# Altium project rpi-hat-v3.PrjPcb
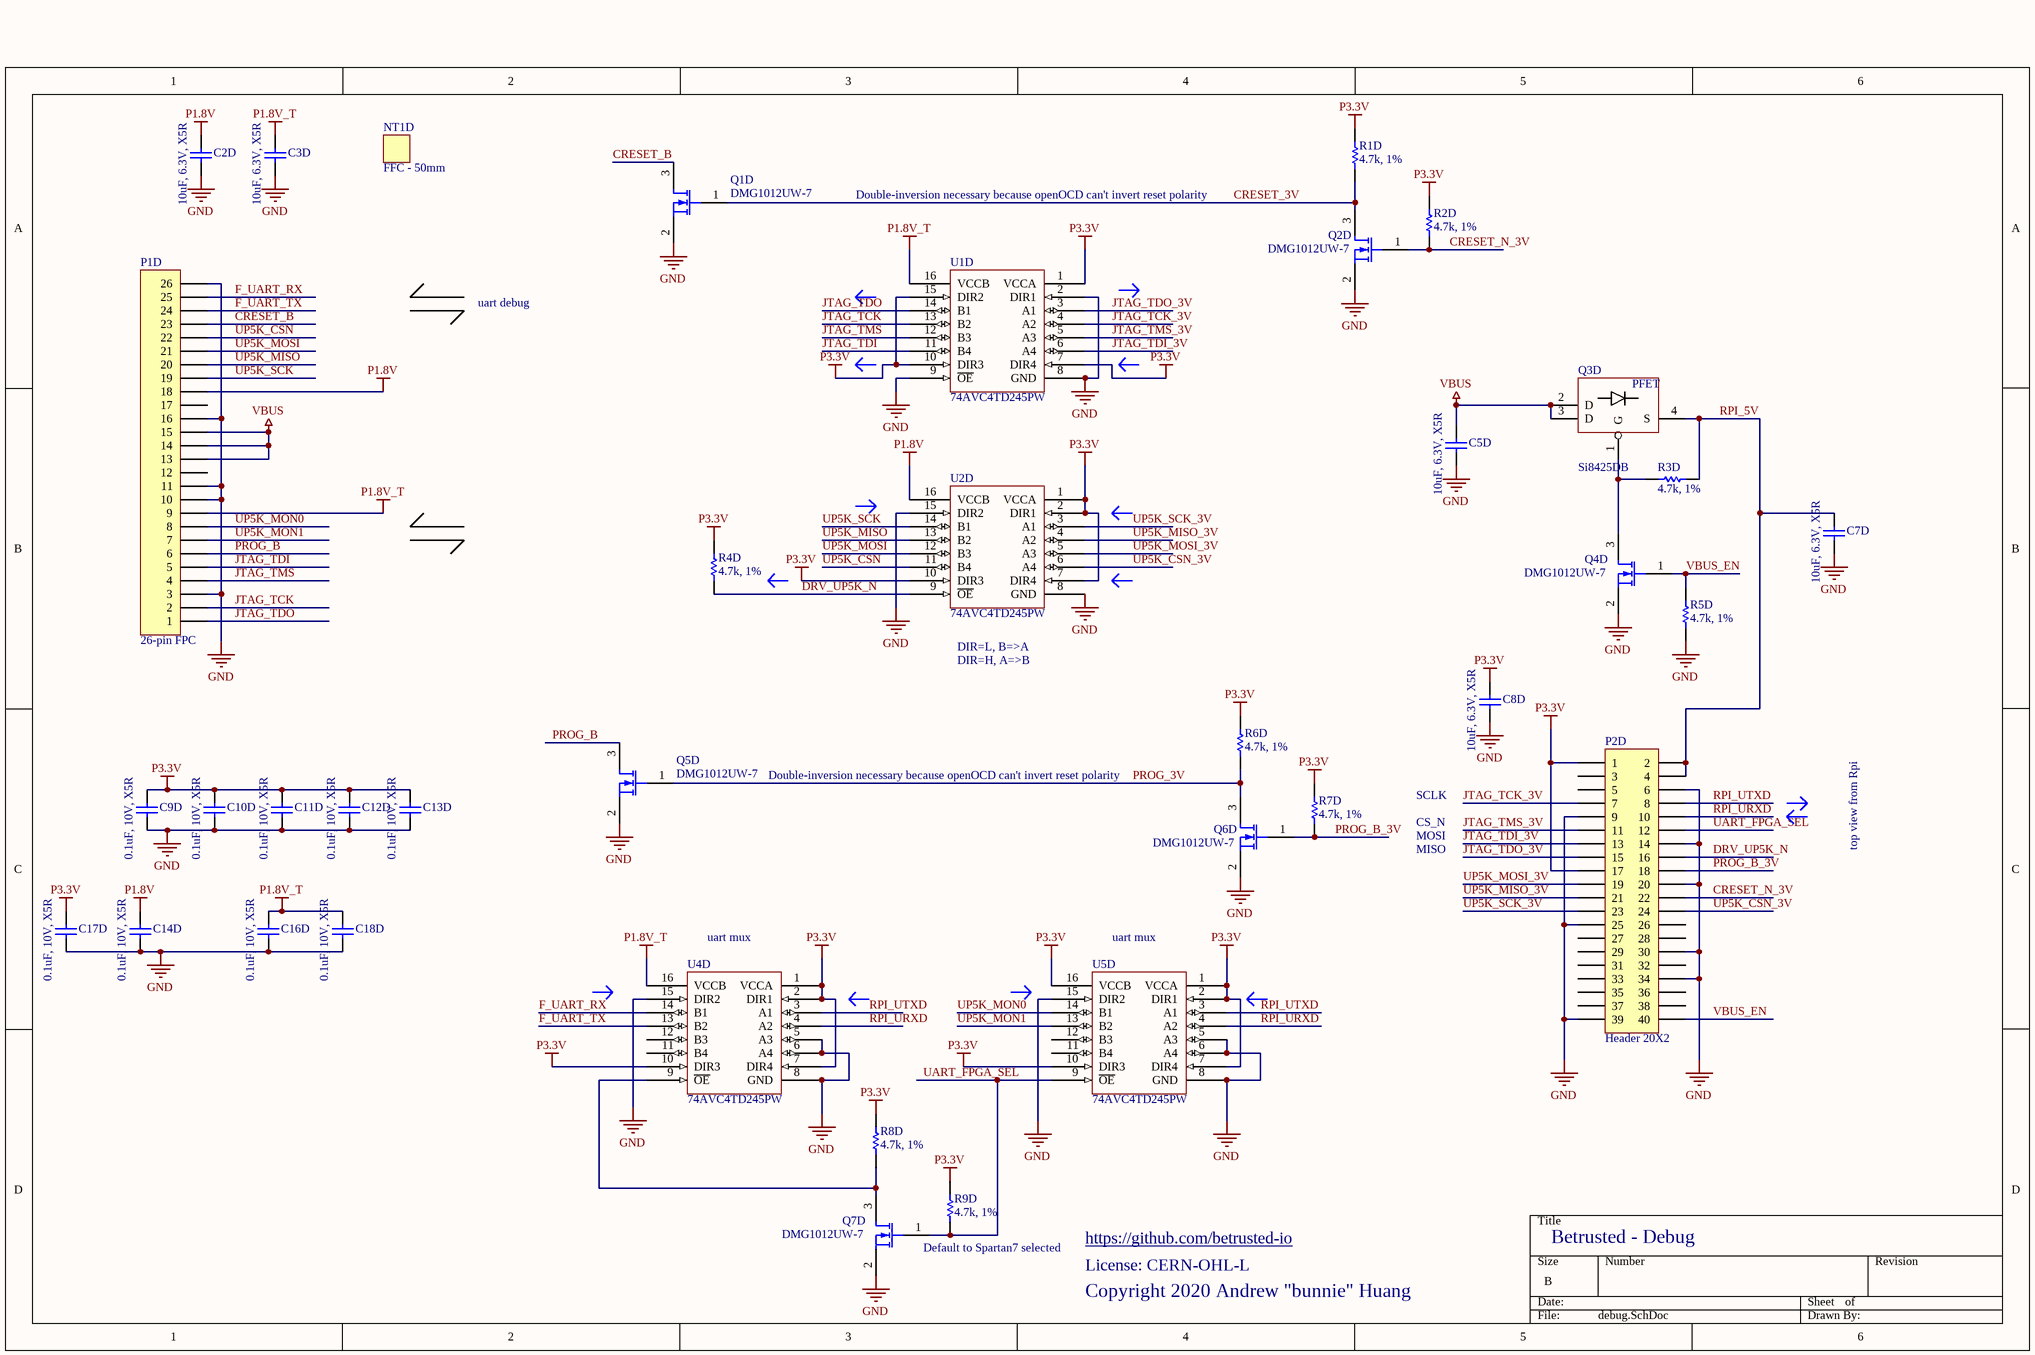
[diagram p0: debug.SchDoc]
2 sheets, 42 parts. Net scope: global (net labels, ports and power ports of the same name join across sheets).
Board file: rpi-hat-v3c.PcbDoc
Sheets:
  debug.SchDoc
  breakout.SchDoc

## Sheet debug.SchDoc
size B

### Parts
C2D  10uF, 6.3V, X5R  [B_CAP0603]
C3D  10uF, 6.3V, X5R  [B_CAP0603]
C5D  10uF, 6.3V, X5R  [B_CAP0603]
C7D  10uF, 6.3V, X5R  [B_CAP0603]
C8D  10uF, 6.3V, X5R  [B_CAP0603]
C9D  0.1uF, 10V, X5R  [B_CAP0402]
C10D  0.1uF, 10V, X5R  [B_CAP0402]
C11D  0.1uF, 10V, X5R  [B_CAP0402]
C12D  0.1uF, 10V, X5R  [B_CAP0402]
C13D  0.1uF, 10V, X5R  [B_CAP0402]
C14D  0.1uF, 10V, X5R  [B_CAP0402]
C16D  0.1uF, 10V, X5R  [B_CAP0402]
C17D  0.1uF, 10V, X5R  [B_CAP0402]
C18D  0.1uF, 10V, X5R  [B_CAP0402]
NT1D  FFC - 50mm
P1D  26-pin FPC  [HRS_FH34SRJ-26S-0.5SH(50)]
P2D  Header 20X2  [SAMTEC_SSW-120-01-F-D]
Q1D  DMG1012UW-7  [SOT323-3AN]
Q2D  DMG1012UW-7  [SOT323-3AN]
Q3D  Si8425DB  [VISHAY_MICRO_FOOT_4_BUMP]
Q4D  DMG1012UW-7  [SOT323-3AN]
Q5D  DMG1012UW-7  [SOT323-3AN]
Q6D  DMG1012UW-7  [SOT323-3AN]
Q7D  DMG1012UW-7  [SOT323-3AN]
R1D  4.7k, 1%  [B_RES0402]
R2D  4.7k, 1%  [B_RES0402]
R3D  4.7k, 1%  [B_RES0402]
R4D  4.7k, 1%  [B_RES0402]
R5D  4.7k, 1%  [B_RES0402]
R6D  4.7k, 1%  [B_RES0402]
R7D  4.7k, 1%  [B_RES0402]
R8D  4.7k, 1%  [B_RES0402]
R9D  4.7k, 1%  [B_RES0402]
U1D  74AVC4TD245PW  [TSOP65P640-16AN]
U2D  74AVC4TD245PW  [TSOP65P640-16AN]
U4D  74AVC4TD245PW  [TSOP65P640-16AN]
U5D  74AVC4TD245PW  [TSOP65P640-16AN]

### Nets
GND: C2D.2 C3D.2 C5D.2 C7D.2 C8D.2 C9D.2 C10D.2 C11D.2 C12D.2 C13D.2 C14D.2 C16D.2 C17D.2 C18D.2 P1D.3 P1D.10 P1D.11 P1D.16 P1D.26 P2D.6 P2D.9 P2D.14 P2D.20 P2D.25 P2D.30 P2D.34 P2D.39 Q1D.2(S) Q2D.2(S) Q4D.2(S) Q5D.2(S) Q6D.2(S) Q7D.2(S) R5D.1 U1D.2(DIR1) U1D.8(GND) U1D.9(~{OE}) U2D.8(GND) U2D.15(DIR2) U4D.5(A3) U4D.6(A4) U4D.8(GND) U4D.15(DIR2) U5D.5(A3) U5D.6(A4) U5D.8(GND) U5D.15(DIR2)
P1.8V: C2D.1 C14D.1 P1D.18 U2D.16(VCCB)
P1.8V_T: C3D.1 C16D.1 C18D.1 P1D.9 U1D.16(VCCB) U4D.16(VCCB)
P3.3V: C8D.1 C9D.1 C10D.1 C11D.1 C12D.1 C13D.1 C17D.1 P2D.1 P2D.17 R1D.2 R2D.2 R4D.2 R6D.2 R7D.2 R8D.2 R9D.2 U1D.1(VCCA) U1D.7(DIR4) U1D.10(DIR3) U1D.15(DIR2) U2D.1(VCCA) U2D.2(DIR1) U2D.7(DIR4) U2D.10(DIR3) U4D.1(VCCA) U4D.2(DIR1) U4D.7(DIR4) U4D.10(DIR3) U5D.1(VCCA) U5D.2(DIR1) U5D.7(DIR4) U5D.10(DIR3) U5D.16(VCCB)
VBUS: C5D.1 P1D.13 P1D.14 P1D.15 Q3D.2(D) Q3D.3(D)
CRESET_3V: Q1D.1(G) Q2D.3(D) R1D.1
CRESET_B: P1D.23 Q1D.3(D)
CRESET_N_3V: P2D.22 Q2D.1(G) R2D.1
DRV_UP5K_N: P2D.16 R4D.1 U2D.9(~{OE})
F_UART_RX: P1D.25 U4D.14(B1)
F_UART_TX: P1D.24 U4D.13(B2)
JTAG_TCK: P1D.2 U1D.13(B2)
JTAG_TCK_3V: P2D.7 U1D.4(A2)
JTAG_TDI: P1D.5 U1D.11(B4)
JTAG_TDI_3V: P2D.13 U1D.6(A4)
JTAG_TDO: P1D.1 U1D.14(B1)
JTAG_TDO_3V: P2D.15 U1D.3(A1)
JTAG_TMS: P1D.4 U1D.12(B3)
JTAG_TMS_3V: P2D.11 U1D.5(A3)
PROG_3V: Q5D.1(G) Q6D.3(D) R6D.1
PROG_B: P1D.6 Q5D.3(D)
PROG_B_3V: P2D.18 Q6D.1(G) R7D.1
RPI_5V: C7D.1 P2D.2 P2D.4 Q3D.4(S) R3D.1
RPI_URXD: P2D.10 U4D.4(A2) U5D.4(A2)
RPI_UTXD: P2D.8 U4D.3(A1) U5D.3(A1)
UART_FPGA_SEL: P2D.12 Q7D.1(G) R9D.1 U5D.9(~{OE})
UP5K_CSN: P1D.22 U2D.11(B4)
UP5K_CSN_3V: P2D.24 U2D.6(A4)
UP5K_MISO: P1D.20 U2D.13(B2)
UP5K_MISO_3V: P2D.21 U2D.4(A2)
UP5K_MON0: P1D.8 U5D.14(B1)
UP5K_MON1: P1D.7 U5D.13(B2)
UP5K_MOSI: P1D.21 U2D.12(B3)
UP5K_MOSI_3V: P2D.19 U2D.5(A3)
UP5K_SCK: P1D.19 U2D.14(B1)
UP5K_SCK_3V: P2D.23 U2D.3(A1)
VBUS_EN: P2D.40 Q4D.1(G) R5D.2
NetQ3D_1: Q3D.1(G) Q4D.3(D) R3D.2
NetQ7D_3: Q7D.3(D) R8D.1 U4D.9(~{OE})

Not connected (* = marked no-connect by the designer): P1D 12 17; P2D 3 5 26 27 28 29 31 32 33 35 36 37 38; U4D 11(B4) 12(B3); U5D 11(B4) 12(B3)

### Notes on the sheet
- Double-inversion necessary because openOCD can't invert reset polarity
- uart debug
- (near U2D) DIR=L, B=>A
- DIR=H, A=>B
- MOSI
- SCLK
- CS_N
- MISO
- top view from Rpi
- (near U4D) uart mux
- (near U5D) uart mux
- https://github.com/betrusted-io
- Betrusted - Debug
- Default to Spartan7 selected
- License: CERN-OHL-L
- Copyright 2020 Andrew "bunnie" Huang
- (in symbol Si8425DB) PFET

### Library data of the parts
C2D C3D C5D C7D C8D = Cap Semi: Capacitor (Semiconductor SIM Model); MPN: CL10A106MQ8NNNC; VENDOR: Samsung; MYPN: C-106-6.3-X5R-0603
C9D C10D C11D C12D C13D C14D C16D C17D C18D = Cap Semi: Capacitor (Semiconductor SIM Model); MPN: CL05A104KP5NNNC; VENDOR: Samsung; MYPN: C-104-10-X5R-0402
NT1D = NOTE: Placeholder for non-board BOM items; MPN: FJH-26-D-02.00-4; MYPN: NT-FFC-26x0.5mm-50mm; VENDOR: Samtec
P1D = FPC-26: 26 Pin FPC header; MPN: FH34SRJ-26S-0.5SH(99); MYPN: J-FPC-0.5mm-26-0.3mm-T/B; VENDOR: Hirose
P2D = Header 20X2: Header, 20-Pin, Dual row; MPN: CS25402-40G-S85-C; VENDOR: Kaweei; MYPN: P-SSW-120-01-F-D; LatestRevisionDate: 17-Jul-2002; LatestRevisionNote: Re-released for DXP Platform.; Publisher: Altium Limited
Q1D Q2D Q4D Q5D Q6D Q7D = MOSFET-N: N-Channel MOSFET; VENDOR: Diodes Inc; MYPN: Q-DMG1012UW-7; Published: 8-Jun-2000; LatestRevisionDate: 17-Jul-2002; LatestRevisionNote: Re-released for DXP Platform.; PackageVersion: 1995/1996; PackageReference: E3; Publisher: Altium Limited; MPN: DMG1012UW-7
Q3D = Si8425DB: P-channel 20V 6.2A 27mOhm @ -2.5V; MPN: SI8425DB-T1-E1; VENDOR: Vishay Siliconix; MYPN: Q-Si8425
R1D R2D R3D R4D R5D R6D R7D R8D R9D = Res1: Resistor; VENDOR: ANY; MYPN: R-472-1P-1_16W-0402; MPN: ANY
U1D U2D U4D U5D = 74AVC4TD245: 4-bit dual supply translating transceiver with configurable voltage translation; 3-state; MYPN: U-74AVC4TD245PW; VENDOR: Nexperia; MPN: 74AVC4TD245PW

## Sheet breakout.SchDoc
size A
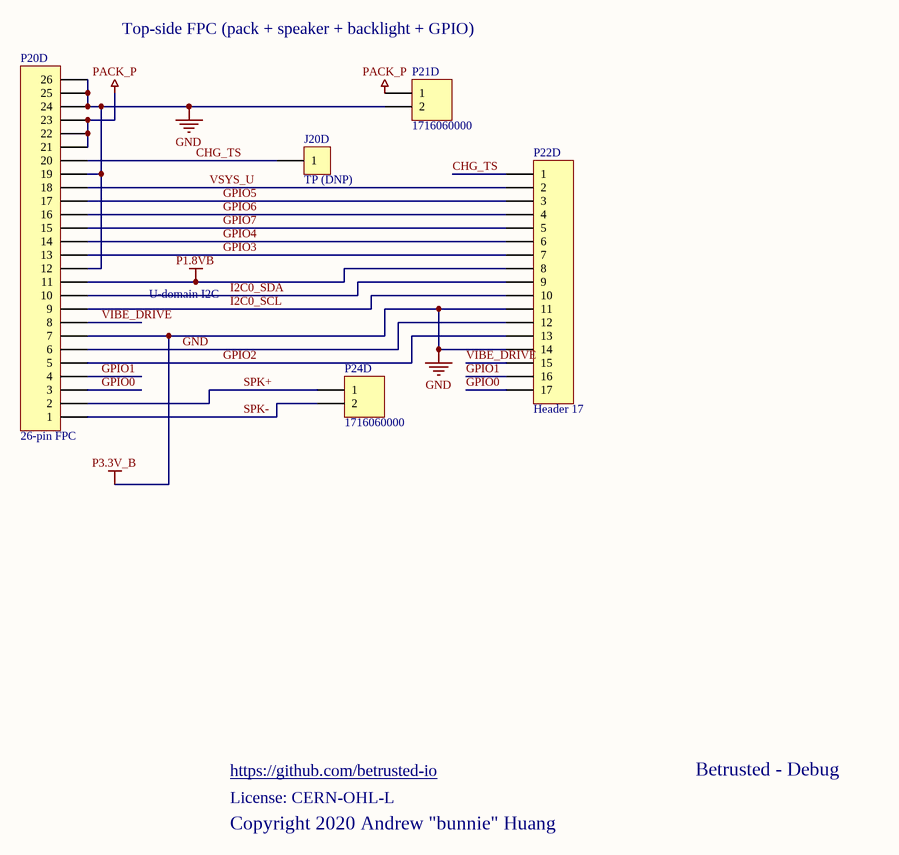
[diagram p1: breakout.SchDoc]

### Parts
J20D  TP (DNP)  [RESTAP-0603]
P20D  26-pin FPC  [HRS_FH34SRJ-26S-0.5SH(50)]
P21D  1716060000  [weidmuller_1716060000]
P22D  Header 17  [HDR1X17]
P24D  1716060000  [weidmuller_1716060000]

### Nets
GND: P20D.6 P20D.7 P20D.12 P20D.19 P20D.24 P20D.25 P20D.26 P21D.2 P22D.11 P22D.12 P22D.14  [also labelled P3.3V_B]
P1.8VB: P20D.11 P22D.8
PACK_P: P20D.21 P20D.22 P20D.23 P21D.1
CHG_TS: J20D.1 P20D.20 P22D.1
GPIO0: P20D.3 P22D.17
GPIO1: P20D.4 P22D.16
GPIO2: P20D.5 P22D.13
GPIO3: P20D.13 P22D.7
GPIO4: P20D.14 P22D.6
GPIO5: P20D.17 P22D.3
GPIO6: P20D.16 P22D.4
GPIO7: P20D.15 P22D.5
I2C0_SCL: P20D.9 P22D.10
I2C0_SDA: P20D.10 P22D.9
SPK+: P20D.2 P24D.1
SPK-: P20D.1 P24D.2
VIBE_DRIVE: P20D.8 P22D.15
VSYS_U: P20D.18 P22D.2

### Notes on the sheet
- Top-side FPC (pack + speaker + backlight + GPIO)
- U-domain I2C
- License: CERN-OHL-L
- Copyright 2020 Andrew "bunnie" Huang
- https://github.com/betrusted-io
- Betrusted - Debug

### Library data of the parts
J20D = CON1: Connector; MYPN: J-TP-PWRTAP-0603; MPN: DNP; VENDOR: DNP
P20D = FPC-26: 26 Pin FPC header; MPN: FH34SRJ-26S-0.5SH(99); MYPN: J-FPC-0.5mm-26-0.3mm-T/B; VENDOR: Hirose; System: Connector
P21D P24D = Header 2: Header, 2-Pin; VENDOR: Weidmuller; MYPN: J-TB-2P-5.08; LatestRevisionDate: 17-Jul-2002; LatestRevisionNote: Re-released for DXP Platform.; Publisher: Altium Limited; MPN: 1716060000
P22D = Header 17: Header, 17-Pin; LatestRevisionDate: 17-Jul-2002; LatestRevisionNote: Re-released for DXP Platform.; Publisher: Altium Limited

## Nets that join several sheets
GND: debug (47 pins), breakout (11 pins)